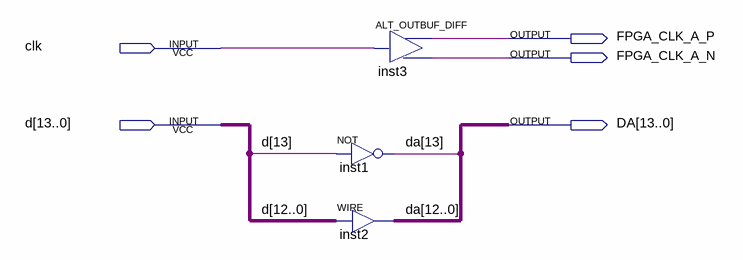
[diagram p0: schematic sheet]
// Quartus schematic DAC_interface.bdf as structural Verilog: 3 symbols, 5 pins
module DAC_interface (
  input  clk,
  input  [13:0] d,
  output FPGA_CLK_A_P,
  output FPGA_CLK_A_N,
  output [13:0] DA
);

  ALT_OUTBUF_DIFF inst3 (.i(clk), .obar(FPGA_CLK_A_N), .o(FPGA_CLK_A_P));
  not inst1 (DA[13], d[13]);
  assign DA[12:0] = d[12:0];  // WIRE inst2
endmodule
